# Altium project Expansion_hv2_conflict-20171103-100927.PrjPcb
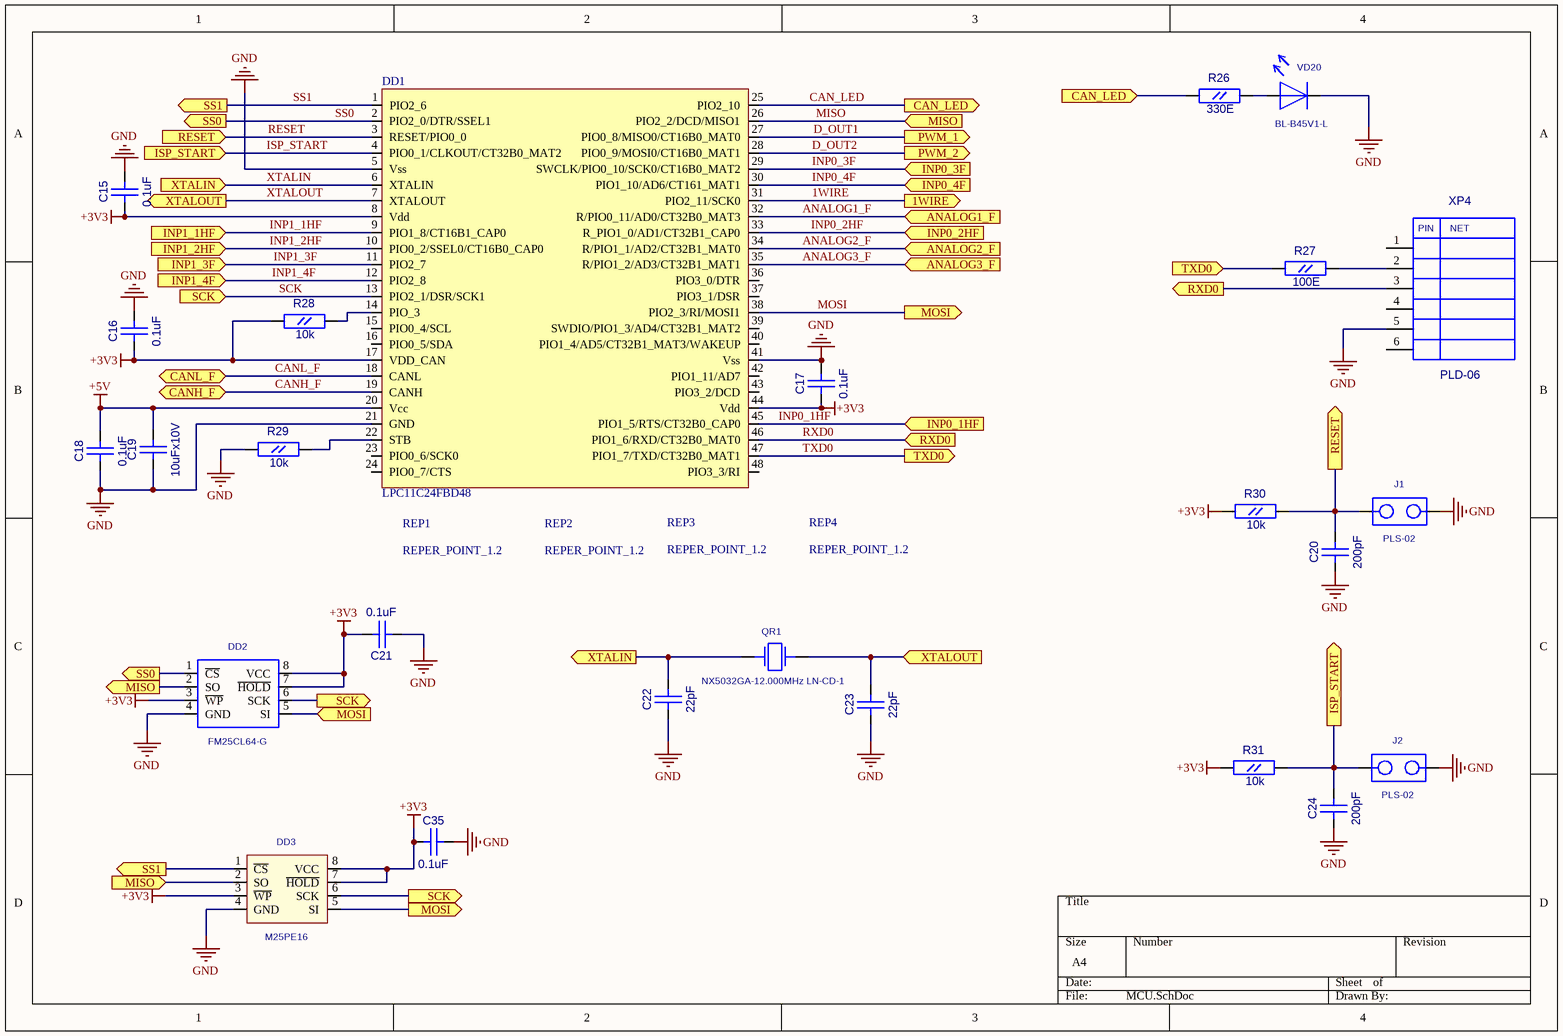
[diagram p0: MCU.SchDoc]
2 sheets, 53 parts. Net scope: flat (ports and power ports of the same name join across sheets).
Board file: Expansion_hv2.PcbDoc
Sheets:
  MCU.SchDoc
  Input_0.SchDoc

## Sheet MCU.SchDoc
size A4

### Parts
C15  0.1uF  [CC0603]
C16  0.1uF  [CC0603]
C17  0.1uF  [CC0603]
C18  0.1uF  [CC0603]
C19  10uFx10V  [CC0805]
C20  200pF  [CC0603]
C21  0.1uF  [CC0603-3M]
C22  22pF  [CC0603]
C23  22pF  [CC0603]
C24  200pF  [CC0603]
C35  0.1uF  [CC0603]
DD1  LPC11C24FBD48  [LQFP-48]
DD2  FM25CL64-G  [SO-8]
DD3  M25PE16  [EIAJ_SO8]
J1  PLS-02  [PLS-02]
J2  PLS-02  [PLS-02]
QR1  NX5032GA-12.000MHz LN-CD-1  [AC5032_2]
R26  330E  [RC0603]
R27  100E  [RC0603]
R28  10k  [RC0603]
R29  10k  [RC0603]
R30  10k  [RC0603]
R31  10k  [RC0603]
REP1  REPER_POINT_1.2  [REPER1.2]
REP2  REPER_POINT_1.2  [REPER1.2]
REP3  REPER_POINT_1.2  [REPER1.2]
REP4  REPER_POINT_1.2  [REPER1.2]
VD20  BL-B45V1-L  [LED3]
XP4  PLD-06  [PIN6]

### Ports
1WIRE (out), ANALOG1_F (in), ANALOG2_F (in), ANALOG3_F (in), CAN_LED (in), CAN_LED (out), CANH_F (bidir), CANL_F (bidir), INP0_1HF (in), INP0_2HF (in), INP0_3F (in), INP0_4F (in), INP1_1HF (in), INP1_2HF (in), INP1_3F (in), INP1_4F (in), ISP_START (in), ISP_START (out), MISO (in), MISO (out), MOSI (in), MOSI (out), PWM_1 (out), PWM_2 (out), RESET (in), RESET (out), RXD0 (in), RXD0 (out), SCK (in), SCK (out), SS0 (out), SS1 (out), TXD0 (in), TXD0 (out), XTALIN (in), XTALIN (out), XTALOUT (in), XTALOUT (out)

### Nets
+3V3: C15.1(A) C16.1(A) C17.1(A) C21.2(B) C35.1(A) DD1.8(Vdd) DD1.17(VDD_CAN) DD1.44(Vdd) DD2.3(~{WP}) DD2.7(~{HOLD}) DD2.8(VCC) DD3.3(~{WP}) DD3.7(~{HOLD}) DD3.8(VCC) R28.1(A) R30.1(A) R31.1(A)
+5V: C18.2(B) C19.2(B) DD1.20(Vcc)
GND: C15.2(B) C16.2(B) C17.2(B) C18.1(A) C19.1(A) C20.1(A) C21.1(A) C22.1(A) C23.1(A) C24.1(A) C35.2(B) DD1.5(Vss) DD1.21(GND) DD1.41(Vss) DD2.4(GND) DD3.4(GND) J1.2 J2.2 R29.1(A) VD20.1 XP4.5
1WIRE: DD1.31(PIO2_11/SCK0) ; port 1WIRE
ANALOG1_F: DD1.32(R/PIO0_11/AD0/CT32B0_MAT3) ; port ANALOG1_F
ANALOG2_F: DD1.34(R/PIO1_1/AD2/CT32B1_MAT0) ; port ANALOG2_F
ANALOG3_F: DD1.35(R/PIO1_2/AD3/CT32B1_MAT1) ; port ANALOG3_F
CAN_LED: DD1.25(PIO2_10) R26.1(A) ; port CAN_LED
CANH_F: DD1.19(CANH) ; port CANH_F
CANL_F: DD1.18(CANL) ; port CANL_F
D_OUT1: DD1.27(PIO0_8/MISO0/CT16B0_MAT0) ; port PWM_1
D_OUT2: DD1.28(PIO0_9/MOSI0/CT16B0_MAT1) ; port PWM_2
INP0_1HF: DD1.45(PIO1_5/RTS/CT32B0_CAP0) ; port INP0_1HF
INP0_2HF: DD1.33(R_PIO1_0/AD1/CT32B1_CAP0) ; port INP0_2HF
INP0_3F: DD1.29(SWCLK/PIO0_10/SCK0/CT16B0_MAT2) ; port INP0_3F
INP0_4F: DD1.30(PIO1_10/AD6/CT161_MAT1) ; port INP0_4F
INP1_1HF: DD1.9(PIO1_8/CT16B1_CAP0) ; port INP1_1HF
INP1_2HF: DD1.10(PIO0_2/SSEL0/CT16B0_CAP0) ; port INP1_2HF
INP1_3F: DD1.11(PIO2_7) ; port INP1_3F
INP1_4F: DD1.12(PIO2_8) ; port INP1_4F
ISP_START: C24.2(B) DD1.4(PIO0_1/CLKOUT/CT32B0_MAT2) J2.1 R31.2(B) ; port ISP_START
MISO: DD1.26(PIO2_2/DCD/MISO1) DD2.2(SO) DD3.2(SO) ; port MISO
MOSI: DD1.38(PIO2_3/RI/MOSI1) DD2.5(SI) DD3.5(SI) ; port MOSI
RESET: C20.2(B) DD1.3(RESET/PIO0_0) J1.1 R30.2(B) ; port RESET
RXD0: DD1.46(PIO1_6/RXD/CT32B0_MAT0) XP4.3 ; port RXD0
SCK: DD1.13(PIO2_1/DSR/SCK1) DD2.6(SCK) DD3.6(SCK) ; port SCK
SS0: DD1.2(PIO2_0/DTR/SSEL1) DD2.1(~{CS}) ; port SS0
SS1: DD1.1(PIO2_6) DD3.1(~{CS}) ; port SS1
TXD0: DD1.47(PIO1_7/TXD/CT32B0_MAT1) R27.1(A) ; port TXD0
XTALIN: C22.2(B) DD1.6(XTALIN) QR1.1 ; port XTALIN
XTALOUT: C23.2(B) DD1.7(XTALOUT) QR1.2 ; port XTALOUT
NetDD1_14: DD1.14(PIO_3) R28.2(B)
NetDD1_22: DD1.22(STB) R29.2(B)
NetR26_2: R26.2(B) VD20.2
NetR27_2: R27.2(B) XP4.2

Not connected (* = marked no-connect by the designer): DD1 15(PIO0_4/SCL) 16(PIO0_5/SDA) 23(PIO0_6/SCK0) 24(PIO0_7/CTS) 36(PIO3_0/DTR) 37(PIO3_1/DSR) 39(SWDIO/PIO1_3/AD4/CT32B1_MAT2) 40(PIO1_4/AD5/CT32B1_MAT3/WAKEUP) 42(PIO1_11/AD7) 43(PIO3_2/DCD) 48(PIO3_3/RI); REP1 1; REP2 1; REP3 1; REP4 1; XP4 1 4 6

### Notes on the sheet
- (in symbol PLD-06) PIN; NET

### Library data of the parts
C15-C18 C20-C24 C35 = CC0603
  C15-C18 C21 C35: Value: 0.1uF
  C20 C24: Value: 200pF
  C22 C23: Value: 22pF
C19 = CC0805: Value: 10uFx10V
DD3 = S25FL016A0LMFI01: Value: M25PE16
QR1 = AC5032_2: AC5032/2; Value: NX5032GA-12.000MHz LN-CD-1
R26-R31 = RC0603
  R26: Value: 330E
  R27: Value: 100E
  R28-R31: Value: 10k
REP1-REP4 = REPER1.2: Value: REPER_POINT_1.2
VD20 = LED_3: Value: BL-B45V1-L
XP4 = PLD-06: PLD06; Value: *
DD1 = LPC11C24FBD48: Value: LPC11C24FBD48
DD2 = FM25CL64-G: Value: *
J1 J2 = PLS-02: Value: *

## Sheet Input_0.SchDoc
size A4
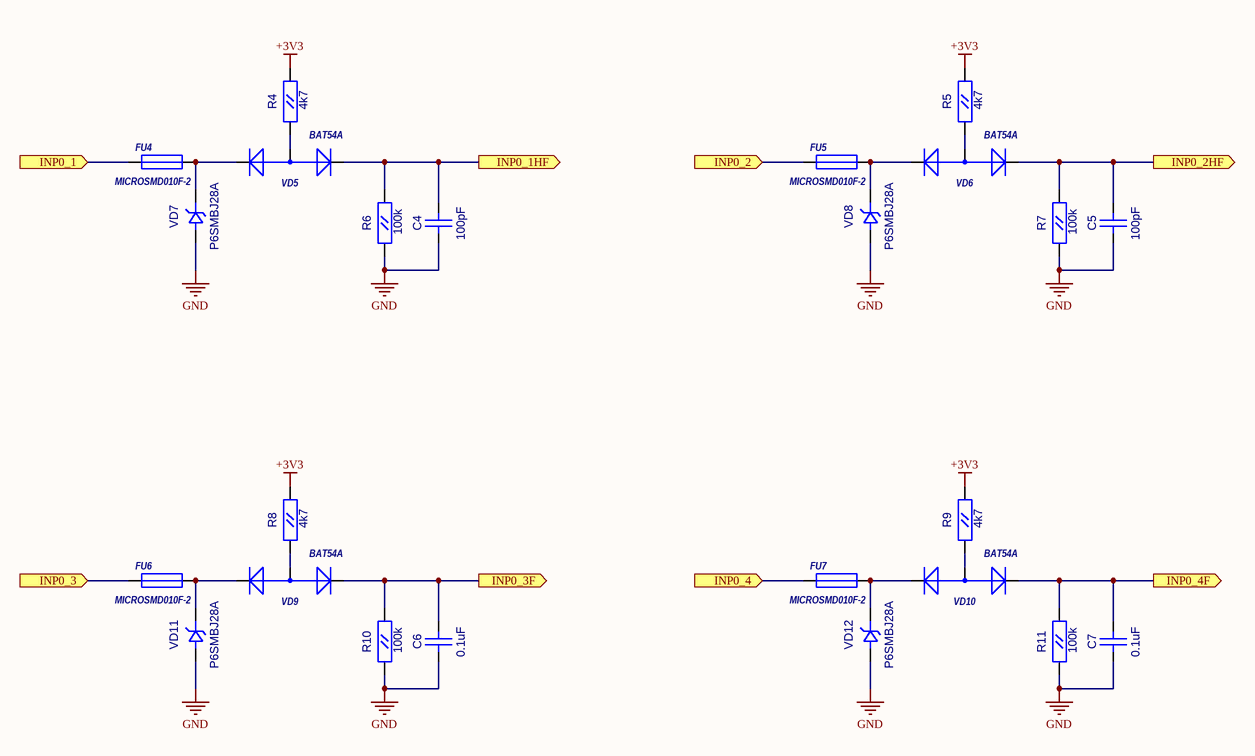
[diagram p1: Input_0.SchDoc]

### Parts
C4  100pF  [CC0603]
C5  100pF  [CC0603]
C6  0.1uF  [CC0603]
C7  0.1uF  [CC0603]
FU4  MICROSMD010F-2  [RC1210]
FU5  MICROSMD010F-2  [RC1210]
FU6  MICROSMD010F-2  [RC1210]
FU7  MICROSMD010F-2  [RC1210]
R4  4k7  [RC0603]
R5  4k7  [RC0603]
R6  100k  [RC0603]
R7  100k  [RC0603]
R8  4k7  [RC0603]
R9  4k7  [RC0603]
R10  100k  [RC0603]
R11  100k  [RC0603]
VD5  BAT54A  [SOT-23(123)]
VD6  BAT54A  [SOT-23(123)]
VD7  P6SMBJ28A  [SMB]
VD8  P6SMBJ28A  [SMB]
VD9  BAT54A  [SOT-23(123)]
VD10  BAT54A  [SOT-23(123)]
VD11  P6SMBJ28A  [SMB]
VD12  P6SMBJ28A  [SMB]

### Ports
INP0_1 (in), INP0_1HF (out), INP0_2 (in), INP0_2HF (out), INP0_3 (in), INP0_3F (out), INP0_4 (in), INP0_4F (out)

### Nets
+3V3: R4.2(B) R5.2(B) R8.2(B) R9.2(B)
GND: C4.1(A) C5.1(A) C6.1(A) C7.1(A) R6.1(A) R7.1(A) R10.1(A) R11.1(A) VD7.1(A) VD8.1(A) VD11.1(A) VD12.1(A)
INP0_1HF: C4.2(B) R6.2(B) VD5.1(K) ; port INP0_1HF
INP0_2HF: C5.2(B) R7.2(B) VD6.1(K) ; port INP0_2HF
INP0_3F: C6.2(B) R10.2(B) VD9.1(K) ; port INP0_3F
INP0_4F: C7.2(B) R11.2(B) VD10.1(K) ; port INP0_4F
NetFU4_1: FU4.1 ; port INP0_1
NetFU4_2: FU4.2 VD5.2(K) VD7.2(K)
NetFU5_1: FU5.1 ; port INP0_2
NetFU5_2: FU5.2 VD6.2(K) VD8.2(K)
NetFU6_1: FU6.1 ; port INP0_3
NetFU6_2: FU6.2 VD9.2(K) VD11.2(K)
NetFU7_1: FU7.1 ; port INP0_4
NetFU7_2: FU7.2 VD10.2(K) VD12.2(K)
NetR4_1: R4.1(A) VD5.3(A)
NetR5_1: R5.1(A) VD6.3(A)
NetR8_1: R8.1(A) VD9.3(A)
NetR9_1: R9.1(A) VD10.3(A)

### Library data of the parts
C4-C7 = CC0603
  C4 C5: Value: 100pF
  C6 C7: Value: 0.1uF
FU4-FU7 = MICROSMD: Value: MICROSMD010F-2
R4-R11 = RC0603
  R4 R5 R8 R9: Value: 4k7
  R6 R7 R10 R11: Value: 100k
VD5 VD6 VD9 VD10 = BAT54A: 1.0 Ampere General Purpose Rectifier; ComponentField6: Published 8-Jun-2000, Modified 11-July-2000: SIM Model Added.; Value: *
VD7 VD8 VD11 VD12 = SMBJ: Value: P6SMBJ28A

## Nets that join several sheets
+3V3: MCU (17 pins), Input_0 (R4.2 R5.2 R8.2 R9.2)
GND: MCU (21 pins), Input_0 (12 pins)
INP0_1HF: MCU (DD1.45), Input_0 (C4.2 R6.2 VD5.1)
INP0_2HF: MCU (DD1.33), Input_0 (C5.2 R7.2 VD6.1)
INP0_3F: MCU (DD1.29), Input_0 (C6.2 R10.2 VD9.1)
INP0_4F: MCU (DD1.30), Input_0 (C7.2 R11.2 VD10.1)